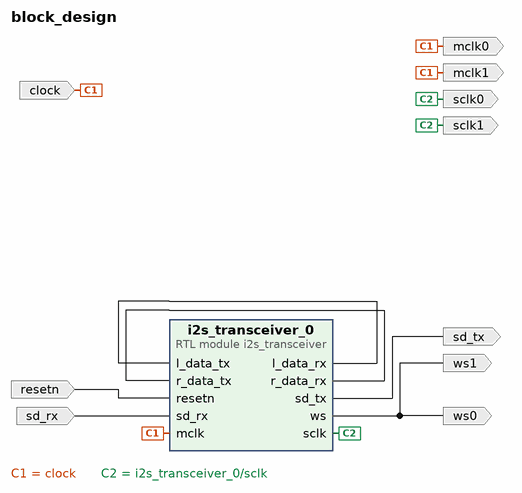
[diagram p0: block diagram of the top level]
# Vivado block design block_design, xc7s25csga225-1, Vivado 2021.2
create_bd_design block_design

create_bd_port -dir I -type clk clock
set_property -dict {CONFIG.FREQ_HZ 12000000} [get_bd_ports clock]
create_bd_port -dir I sd_rx
create_bd_port -dir O sd_tx
create_bd_port -dir I resetn
create_bd_port -dir O mclk1
create_bd_port -dir O mclk0
create_bd_port -dir O sclk0
create_bd_port -dir O sclk1
create_bd_port -dir O ws0
create_bd_port -dir O ws1

create_bd_cell -type module -reference i2s_transceiver i2s_transceiver_0

# ---- connections ----

connect_bd_net [get_bd_ports clock] [get_bd_pins i2s_transceiver_0/mclk] [get_bd_ports mclk0] [get_bd_ports mclk1]
connect_bd_net [get_bd_pins i2s_transceiver_0/l_data_rx] [get_bd_pins i2s_transceiver_0/l_data_tx]
connect_bd_net [get_bd_pins i2s_transceiver_0/r_data_rx] [get_bd_pins i2s_transceiver_0/r_data_tx]
connect_bd_net [get_bd_pins i2s_transceiver_0/sclk] [get_bd_ports sclk0] [get_bd_ports sclk1]
connect_bd_net [get_bd_pins i2s_transceiver_0/sd_tx] [get_bd_ports sd_tx]
connect_bd_net [get_bd_pins i2s_transceiver_0/ws] [get_bd_ports ws0] [get_bd_ports ws1]
connect_bd_net [get_bd_ports resetn] [get_bd_pins i2s_transceiver_0/resetn]
connect_bd_net [get_bd_ports sd_rx] [get_bd_pins i2s_transceiver_0/sd_rx]

validate_bd_design
save_bd_design
